# Altium schematic sheet Fuel Level Monitoring System.SchDoc: Fuel Level Monitoring System
size A2; SheetNumber: 1; SheetTotal: 1
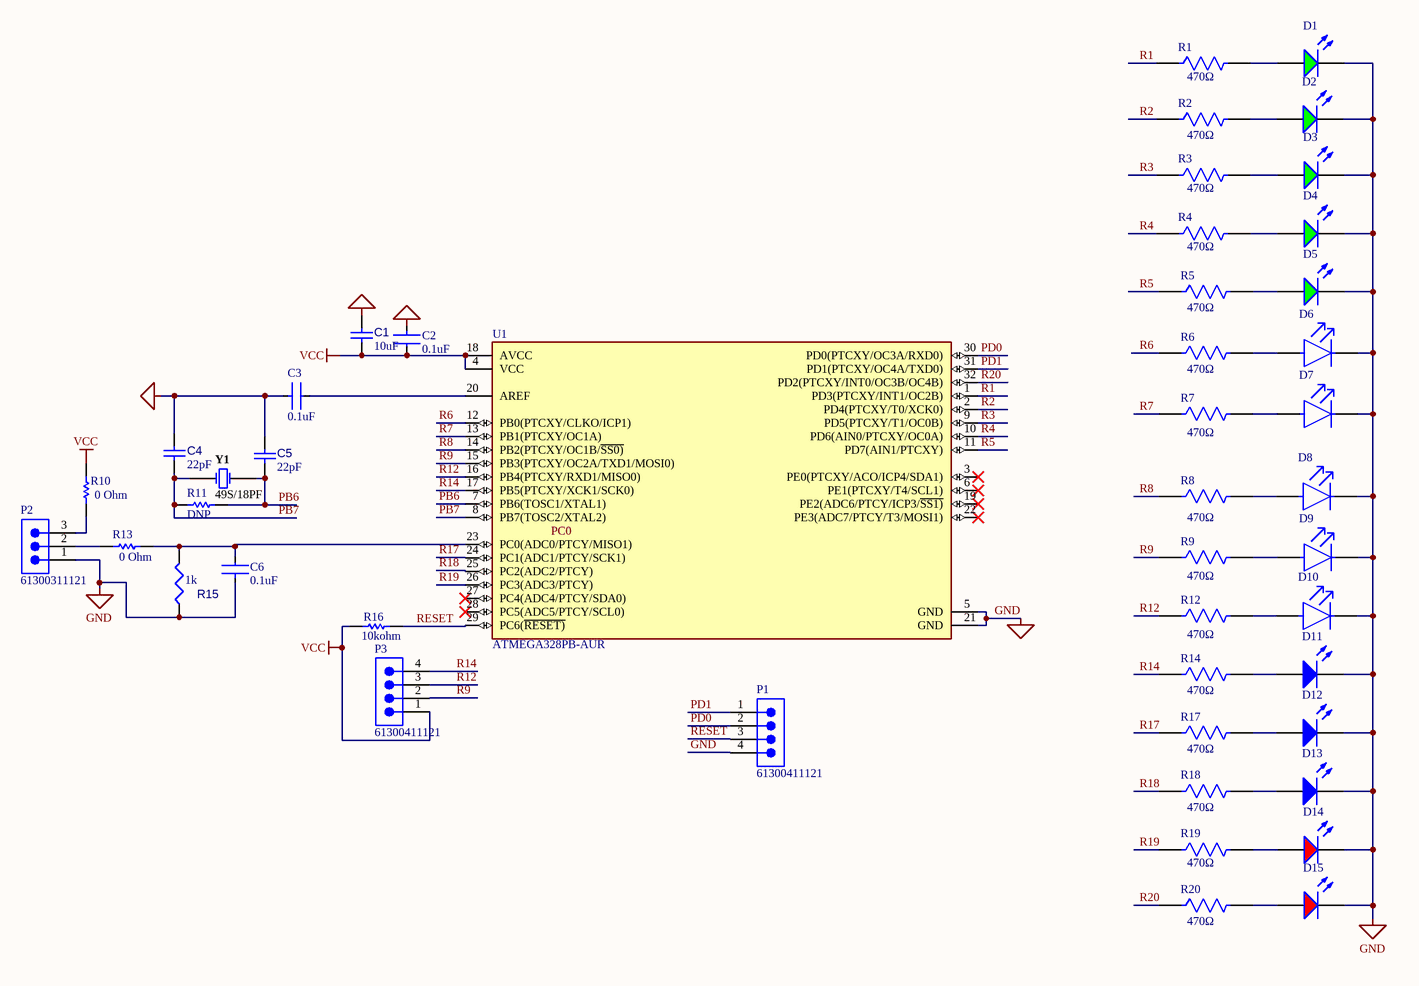
[diagram p0: Fuel Level Monitoring System.SchDoc]

## Parts
C1  value 10uF  [CAPC0603(1608)100_L]  (hidden comment: Capacitor 10µF +/-20% 10V 0603)
C2  0.1uF  [FP-CC0805-0_85-MFG]
C3  0.1uF  [FP-CC0805-0_85-MFG]
C4  value 22pF  [CAPC0402(1005)60_L]  (hidden comment: Capacitor 22pF +/-10% 50V 0402)
C5  value 22pF  [CAPC0402(1005)60_L]  (hidden comment: Capacitor 22pF +/-10% 50V 0402)
C6  0.1uF  [FP-CC0805-0_85-MFG]
D1  150120GS75000  [WL-SMCW_1206_150120xx75000]  (value not drawn)
D2  150120GS75000  [WL-SMCW_1206_150120xx75000]  (value not drawn)
D3  150120GS75000  [WL-SMCW_1206_150120xx75000]  (value not drawn)
D4  150120GS75000  [WL-SMCW_1206_150120xx75000]  (value not drawn)
D5  150120GS75000  [WL-SMCW_1206_150120xx75000]  (value not drawn)
D6  LTST-C150KSKT  [FP-LTST-C150KSKT-MFG]  (value not drawn)
D7  LTST-C150KSKT  [FP-LTST-C150KSKT-MFG]  (value not drawn)
D8  LTST-C150KSKT  [FP-LTST-C150KSKT-MFG]  (value not drawn)
D9  LTST-C150KSKT  [FP-LTST-C150KSKT-MFG]  (value not drawn)
D10  LTST-C150KSKT  [FP-LTST-C150KSKT-MFG]  (value not drawn)
D11  150120BS75000  [WL-SMCW_1206_150120xx75000]  (value not drawn)
D12  150120BS75000  [WL-SMCW_1206_150120xx75000]  (value not drawn)
D13  150120BS75000  [WL-SMCW_1206_150120xx75000]  (value not drawn)
D14  150120RS75000  [WL-SMCW_1206_150120xx75000]  (value not drawn)
D15  150120RS75000  [WL-SMCW_1206_150120xx75000]  (value not drawn)
P1  61300411121  [61300411121]
P2  61300311121  [61300311121]
P3  61300411121  [61300411121]
R1  value 470Ω  [FP-CRGCQ0805-IPC_C]  (hidden comment: CRGCQ0805J470R)
R2  value 470Ω  [FP-CRGCQ0805-IPC_C]  (hidden comment: CRGCQ0805J470R)
R3  value 470Ω  [FP-CRGCQ0805-IPC_C]  (hidden comment: CRGCQ0805J470R)
R4  value 470Ω  [FP-CRGCQ0805-IPC_C]  (hidden comment: CRGCQ0805J470R)
R5  Resistance: 470Ω  [FP-CRGCQ0805-IPC_C]  (hidden comment: CRGCQ0805J470R)
R6  Resistance: 470Ω  [FP-CRGCQ0805-IPC_C]  (hidden comment: CRGCQ0805J470R)
R7  Resistance: 470Ω  [FP-CRGCQ0805-IPC_C]  (hidden comment: CRGCQ0805J470R)
R8  value 470Ω  [FP-CRGCQ0805-IPC_C]  (hidden comment: CRGCQ0805J470R)
R9  Resistance: 470Ω  [FP-CRGCQ0805-IPC_C]  (hidden comment: CRGCQ0805J470R)
R10  Resistance: 0 Ohm  [RESC2013X60X35ML10T20]  (hidden comment: RC0805JR-070RL)
R11  Resistance: DNP  [RESC2013X60X35ML10T20]  (hidden comment: RC0805JR-070RL)
R12  value 470Ω  [FP-CRGCQ0805-IPC_C]  (hidden comment: CRGCQ0805J470R)
R13  Resistance: 0 Ohm  [RESC2013X60X35ML10T20]  (hidden comment: RC0805JR-070RL)
R14  Resistance: 470Ω  [FP-CRGCQ0805-IPC_C]  (hidden comment: CRGCQ0805J470R)
R15  value 1k  [RESC0805(2012)_L]  (hidden comment: Resistor 1K +/-5% 0805 125 mW)
R16  Resistance: 10kohm  [RESC2013X60X35ML10T20]  (hidden comment: RC0805JR-0710KL)
R17  Resistance: 470Ω  [FP-CRGCQ0805-IPC_C]  (hidden comment: CRGCQ0805J470R)
R18  Resistance: 470Ω  [FP-CRGCQ0805-IPC_C]  (hidden comment: CRGCQ0805J470R)
R19  Resistance: 470Ω  [FP-CRGCQ0805-IPC_C]  (hidden comment: CRGCQ0805J470R)
R20  Resistance: 470Ω  [FP-CRGCQ0805-IPC_C]  (hidden comment: CRGCQ0805J470R)
U1  ATMEGA328PB-AUR  [FP-C04-074-MFG]
Y1  49S/18PF  [JPY-49S-18PF]

## Nets
GND: C1.2 C2.1 C3.1 C4.2 C5.2 C6.1 D1.1(K) D2.1(K) D3.1(K) D4.1(K) D5.1(K) D6.1(C) D7.1(C) D8.1(C) D9.1(C) D10.1(C) D11.1(K) D12.1(K) D13.1(K) D14.1(K) D15.1(K) P1.4 P2.1 R15.1 U1.5(GND) U1.21(GND)
VCC: C1.1 C2.2 P3.1 R10.2 R16.2 U1.4(VCC) U1.18(AVCC)
PB6: C5.1 R11.1 U1.7(PB6(TOSC1/XTAL1)) Y1.2
PB7: C4.1 R11.2 U1.8(PB7(TOSC2/XTAL2)) Y1.1
PD0: P1.2 U1.30(PD0(PTCXY/OC3A/RXD0))
PD1: P1.1 U1.31(PD1(PTCXY/OC4A/TXD0))
R1: R1.1 U1.1(PD3(PTCXY/INT1/OC2B))
R2: R2.1 U1.2(PD4(PTCXY/T0/XCK0))
R3: R3.1 U1.9(PD5(PTCXY/T1/OC0B))
R4: R4.1 U1.10(PD6(AIN0/PTCXY/OC0A))
R5: R5.1 U1.11(PD7(AIN1/PTCXY))
R6: R6.1 U1.12(PB0(PTCXY/CLKO/ICP1))
R7: R7.1 U1.13(PB1(PTCXY/OC1A))
R8: R8.1 U1.14(PB2(PTCXY/OC1B/~{SS0)})
R9: P3.2 R9.1 U1.15(PB3(PTCXY/OC2A/TXD1/MOSI0))
R12: P3.3 R12.1 U1.16(PB4(PTCXY/RXD1/MISO0))
R14: P3.4 R14.1 U1.17(PB5(PTCXY/XCK1/SCK0))
R17: R17.1 U1.24(PC1(ADC1/PTCY/SCK1))
R18: R18.1 U1.25(PC2(ADC2/PTCY))
R19: R19.1 U1.26(PC3(ADC3/PTCY))
R20: R20.1 U1.32(PD2(PTCXY/INT0/OC3B/OC4B))
RESET: P1.3 R16.1 U1.29(PC6(~{RESET)})
NetC3_2: C3.2 U1.20(AREF)
NetC6_2: C6.2 R13.2 R15.2 U1.23(PC0(ADC0/PTCY/MISO1))
NetD1_2: D1.2(A) R1.2
NetD2_2: D2.2(A) R2.2
NetD3_2: D3.2(A) R3.2
NetD4_2: D4.2(A) R4.2
NetD5_2: D5.2(A) R5.2
NetD6_2: D6.2(A) R6.2
NetD7_2: D7.2(A) R7.2
NetD8_2: D8.2(A) R8.2
NetD9_2: D9.2(A) R9.2
NetD10_2: D10.2(A) R12.2
NetD11_2: D11.2(A) R14.2
NetD12_2: D12.2(A) R17.2
NetD13_2: D13.2(A) R18.2
NetD14_2: D14.2(A) R19.2
NetD15_2: D15.2(A) R20.2
NetP2_2: P2.2 R13.1
NetP2_3: P2.3 R10.1

Not connected (* = marked no-connect by the designer): U1 3(PE0(PTCXY/ACO/ICP4/SDA1))* 6(PE1(PTCXY/T4/SCL1))* 19(PE2(ADC6/PTCY/ICP3/~{SS1)})* 22(PE3(ADC7/PTCY/T3/MOSI1))* 27(PC4(ADC4/PTCY/SDA0))* 28(PC5(ADC5/PTCY/SCL0))*

## Notes on the sheet
- Labels drawn without touching a wire or pin: PC0

## Library data of the parts
C1 = CMP-001-00075-4: Chip Capacitor, 10µF +/-20%, 10V, 0603, Thickness 1 mm; Tolerance: 10%; Voltage Rating: 10V; Max Operating Temperature: 85°C; Pins: 2; Case/Package: 0603; Mounting Technology: SMT; Min Operating Temperature: -55°C
C2 C3 C6 = CMP-2100-03606-3: CAP CER 0.1UF 50V X7R 0805; Manufacturer Part Number: CC0805KRX7R9BB104; Manufacturer: Yageo; Tolerance: 0.1; Capacitance: 100 nF; Value: 100 nF; Material: Ceramic; Device Class L1: Passive Components; ComponentLink2Description: Datasheet; Package: CC0805-0.85; Digikey Description: CAP CER 0.1UF 50V X7R 0805; Device Class L3: Ceramic Capacitors; Temperature: -30°C to +85°C; Temperature Characteristic: X7R; Voltage Rating: 50 V; Height: 0.95mm; RoHS: TRUE; Ipc Land Pattern Name: CAPC200125X85; Device Class L2: Capacitors; Category: Cap; Temperature Range Low: -30°C; Temperature Range High: +85°C; Mouser Description: Multilayer Ceramic Capacitors MLCC - SMD/SMT 100nF 50V X7R 10%; Footprint Url: http://www.yageo.com/exep/pages/download/literatures/UPY-C_GEN_24.pdf; Automotive: No; Octopart: https://octopart.com/cc0805krx7r9bb104-yageo-192993; Lead Free: Yes; ComponentLink2URL: http://www.yageo.com/documents/recent/UPY-GPHC_Y5V_6.3V-to-50V_8.pdf
C4 C5 = CMP-001-00073-3: Chip Capacitor, 22pF +/-10%, 50V, 0402, Thickness 0.6 mm; Tolerance: 10%; Pins: 2; Voltage Rating: 50V; Max Operating Temperature: 85°C; Min Operating Temperature: -55°C; Mounting Technology: SMT; Case/Package: 0402
D1-D5 = CMP-1426-00014-4: WL-SMCW SMT Mono-Color Chip LED Waterclear; Dominant Wavelength: 525nm; Reverse Voltage: 5V; Max Junction Temperature (Tj): 95°C; Lens Style: Clear, Rectangular; Forward Voltage: 3.2V; Power Dissipation: 105mW; Peak Wavelength: 515nm; Test Current: 20mA; Color: Green; Forward Current: 100mA; Luminous Intensity: 450mcd; Viewing Angle: 140°; Case Code (Imperial): 1206; REACH SVHC: Unknown; Packaging: Tape and Reel; Max Operating Temperature: 85°C; Case/Package: 1206; Height: 680µm; Length: 3.2mm; Mount: Surface Mount; Min Operating Temperature: -40°C; Width: 1.6mm; Case Code (Metric): 3216; Max Reverse Voltage (DC): 5V; RoHS: Compliant; Wavelength: 525nm
D6-D10 = CMP-2000-06618-2: LED YELLOW CLEAR 1206 SMD; Power Rating: 75mW; Wavelength: 588nm; Forward Current: 30mA; Test Current: 20mA; Viewing Angle: 130°; Forward Voltage: 2.4V; Luminous Intensity: 60mcd; Lens Style: Diffused; Number of Elements: 1; Reverse Voltage: 5V; Lens Color: Colorless; Dominant Wavelength: 587nm; Mount: Surface Mount; Min Operating Temperature: -55°C; Depth: 1.6mm; Max Operating Temperature: 85°C; Color: Yellow; Power Dissipation: 75mW; Width: 1.6mm; Packaging: Tape and Reel; Length: 3.2mm; Illumination Color: Yellow; Number of Pins: 2; Case Code (Metric): 3216; Lead Free: Lead Free; Package Quantity: 1; Radiation Hardening: No; Height: 1.1mm; Case Code (Imperial): 1206; Number of LEDs: 1; Case/Package: 1206; Lens Transparency: Clear
D11-D13 = CMP-1426-00015-3: WL-SMCW SMT Mono-Color Chip LED Waterclear; Manufacturer Package Identifier: LED_1206; Dominant Wavelength: 470nm; Lens Style: Clear, Rectangular; Test Current: 20mA; Forward Voltage: 3.2V; Forward Current: 100mA; Peak Wavelength: 465nm; Max Reverse Voltage (DC): 5V; Viewing Angle: 140°; Color: Blue; Luminous Intensity: 145mcd; Max Operating Temperature: 85°C; Case Code (Imperial): 1206; Length: 3.2mm; Width: 1.6mm; Min Operating Temperature: -40°C; Height: 680µm; Case Code (Metric): 3216; Packaging: Tape and Reel; RoHS: Compliant; Case/Package: 1206; REACH SVHC: Unknown; Wavelength: 470nm; Mount: Surface Mount
D14 D15 = CMP-1426-00013-4: WL-SMCW SMT Mono-Color Chip LED Waterclear; Luminous Intensity: 150mcd; Max Junction Temperature (Tj): 95°C; Lens Style: Clear, Rectangular; Color: Red; Wavelength: 625nm; Forward Current: 100mA; Test Current: 20mA; Power Dissipation: 72mW; Forward Voltage: 2V; Peak Wavelength: 630nm; Reverse Voltage: 5V; Viewing Angle: 140°; Length: 3.2mm; Case Code (Imperial): 1206; Mount: Surface Mount; Case/Package: 1206; Packaging: Tape and Reel; REACH SVHC: Unknown; Max Operating Temperature: 85°C; RoHS: Compliant; Height: 680µm; Dominant Wavelength: 625nm; Width: 1.6mm; Max Reverse Voltage (DC): 5V; Case Code (Metric): 3216; Min Operating Temperature: -40°C
P1 P3 = CMP-1502-01064-3: NexarPartId: 32855522; Operating Supply Voltage: 250V; Pitch: 2.54mm; Contact Resistance: 20mΩ; Number of Positions: 4; Current Rating: 3A; Connector Type: Male Pin; Gender: Male; Contact Plating: Gold; Height: 8.89mm; Lead Pitch: 2.54mm; Lead Free: Lead Free; Contact Mating Length: 5.9944mm; Number of Rows: 1; Termination: Solder; Packaging: Bulk; REACH SVHC: Unknown; Min Operating Temperature: -40°C; RoHS: Compliant; Number of Contacts: 4; Voltage Rating: 250V; Color: Black; Max Operating Temperature: 105°C; Contact Material: Copper; Mount: Through Hole; Orientation: Vertical; Number of Pins: 4
P2 = CMP-1502-01062-3: NexarPartId: 32855521; Current Rating: 3A; Voltage Rating: 250V; Number of Positions: 3; Pitch: 2.54mm; Contact Resistance: 20mΩ; Connector Type: Male Pin; Gender: Male; REACH SVHC: Unknown; Packaging: Bulk; Contact Material: Copper; Min Operating Temperature: -40°C; Number of Rows: 1; Orientation: Vertical; RoHS: Compliant; Contact Plating: Gold; Max Operating Temperature: 105°C; Mount: Through Hole; Height: 8.94mm; Operating Supply Voltage: 250V; Number of Pins: 3; Contact Mating Length: 5.9944mm; Number of Contacts: 3; Color: Black; Lead Free: Lead Free; Lead Pitch: 2.54mm; Termination: Solder
R1-R9 R12 R14 R17-R20 = CMP-03211-002267-1: CRGCQ0805 470Ω 0.125W ±100ppm/°C 5% 150V; Manufacturer: TE Connectivity; Tolerance: 0.05; Automotive Grade: Grade 610; Temperature Range Low: -55°C; Power Rating: 0.125W; Temperature: -55°C to +155°C; Height: 0.65mm; Temperature Coefficient: ±100ppm/°C; Composition: Thick Film; Ambient Temperature Range High: +70°C; Category: Res; Automotive: Yes; Series: CRGCQ; Package: CRGCQ0805; Manufacturer Part Number: CRGCQ0805J470R; Device Class L3: Chip SMD Resistors; ComponentLink2URL: https://www.te.com/commerce/DocumentDelivery/DDEController?Action=showdoc&DocId=Data+Sheet%7F1773204-3%7F1%7Fpdf%7FEnglish%7FENG_DS_1773204-3_1.pdf%7F4-2176341-619; Device Class L2: Resistors; Octopart: https://octopart.com/crgcq0805j470r-te+connectivity-91018229; Voltage Rating: 150V; Ipc Land Pattern Name: RESC200125X55; Temperature Range High: +155°C; Device Class L1: Passive Components; ComponentLink2Description: Datasheet; RoHS: TRUE; Lead Free: Yes
  R1-R4 R8 R12: Resistance: 470Ω
  R5-R7 R9 R14 R17-R20: Value: 470Ω
R10 R11 R13 = CMP-2100-03673-1: Chip Resistor, 0 Ohm, Jumper, +/- 5%, 0.125 W, -55 to 155 degC, 0805 (2012 Metric), RoHS, Tape and Reel; Manufacturer: Yageo; Power Rating: 125mW; Voltage Rating (DC): 150V; Temperature Coefficient: 200ppm/degreesC; Height: 0.5mm; Depth: 1.25mm; Case Code (Imperial): 0805; Lead Free: LeadFree; Military Standard: Not; Package Description: 2-Pin Surface Mounted Device, Body 2 x 1.25 mm; Case Code (Metric): 2012; Composition: ThickFilm; Voltage Rating: 150V; Manufacturer URL: http://www.yageo.com/; Packaging: TapeandReel; Package Reference: 0805; REACH SVHC: Unknown; Tolerance: 5%; Case/Package: 0805; Max Operating Temperature: 155degC; Number of Pins: 2; Min Operating Temperature: -55degC; RoHSCompliant: true; Length: 2mm; Datasheet URL: http://www.yageo.com/NewPortal/yageodocoutput?fileName=/pdf/R-Chip/PYu-RC_Group_51_RoHS_L_5.pdf; Termination: SMD/SMT; Radiation Hardening: No; Width: 1.25mm; Contact Plating: Tin; Datasheet Version: Rev. 5, 10/2016
R15 = CMP-009-00118-3: Chip Resistor, 1 kOhms, +/-5%, 125 mW, -55 to 155 degC, 0805; Tolerance: 5%; Power: 125mW; Case/Package: 0805; Pins: 2; Min Operating Temperature: -55°C; Max Operating Temperature: 155°C
R16 = CMP-2000-05025-1: Chip Resistor, 10 KOhm, +/- 5%, 0.125 W, -55 to 155 degC, 0805 (2012 Metric), RoHS, Tape and Reel; Manufacturer: Yageo; Resistor Element Type: ThickFilm; Voltage Rating: 150V; Product Range: RCSeries; SVHC: ToBeAdvised; Resistor Case Style: 0805[2012Metric]; Temperature Coefficient: ±100ppm/degC; Power Rating: 250mW; Automotive Qualification Standard: -; Datasheet Version: REV. 2, 09/2004; Packaging: CutTape; Resistance Tolerance: ±5%; MSL: MSL1-Unlimited; Manufacturer URL: http://www.yageo.com/; Datasheet URL: http://www.yageo.ru/pdf/RC0805.pdf; Package Description: 2-Pin Surface Mounted Device, Body 2 x 1.25 mm; Package Reference: 805
U1 = CMP-06276-000006-1: IC MCU 8BIT 32KB FLASH 32TQFP; Manufacturer: Microchip; Ram Size: 2KBytes; Number Of Spi Channels: 2; Interface: I2C,SPI,UART,USART,2-Wire; Number Of Pwm Channels: 10; Nominal Supply Current: 0.06-5.2mA; Number Of Timers/Counters: 5; Number Of Cores: 1; Memory Size: 32KBytes; Frequency: 20MHz; Min Supply Voltage: 1.8V; Core Architecture: AVR; Data Bus Width: 8bits; Max Supply Voltage: 5.5V; Standoff Height: 0.05mm; Number Of Adc Channels: 8; Number Of I/Os: 27; RoHS: TRUE; Automotive: No; Temperature Range Low: -40°C; Category: IC; Octopart: https://octopart.com/atmega328pb-aur-microchip-77760229; Height: 1.2mm; Number Of I2C Channels: 2; Digikey Description: IC MCU 8BIT 32KB FLASH 32TQFP; Number Of Uart Channels: 2; Manufacturer Part Number: ATMEGA328PB-AUR; ComponentLink2Description: Datasheet; Device Class L1: Integrated Circuits (ICs); Package: C04-074; Lead Free: Yes; Temperature Range High: +85°C; Temperature: -40°C to +85°C; Memory Type: FLASH; Number Of A/D Converters: 1; Device Class L2: Embedded Processors and Controllers; ComponentLink2URL: http://ww1.microchip.com/downloads/en/DeviceDoc/40001906C.pdf; Device Class L3: Microcontrollers; Ipc Land Pattern Name: QFP80P900X900X120-32; Footprint Url: https://ww1.microchip.com/downloads/en/DeviceDoc/32L_TQFP_7x7x1_0mm_PT_C04-00074c.pdf
Y1 = CMP-003-00000-2: Crystal, 16 MHz, +/-20 ppm, 18 pF, -20 to 70 degC, 2-Pin THD, RoHS; Manufacturer: Shenzhen Jingpengyuan; Frequency: 16MHz; Package Description: 2-Pin Through Hole Device, Body 11.05 x 4.65 mm, Pitch 4.88 mm; Mounting Technology: TH; Datasheet Version: Aug-14; Package Reference: 49S-18PF; RoHS Compliant: Unknown; Datasheet URL: http://datasheet.octopart.com/49S-18PF-Xinhunjing-datasheet-30677139.pdf; Case/Package: 49S-18PF; Manufacturer URL: http://www.chjiahui.com/